# Altium project UZ_isoJTAG_Adapter.PrjPcb
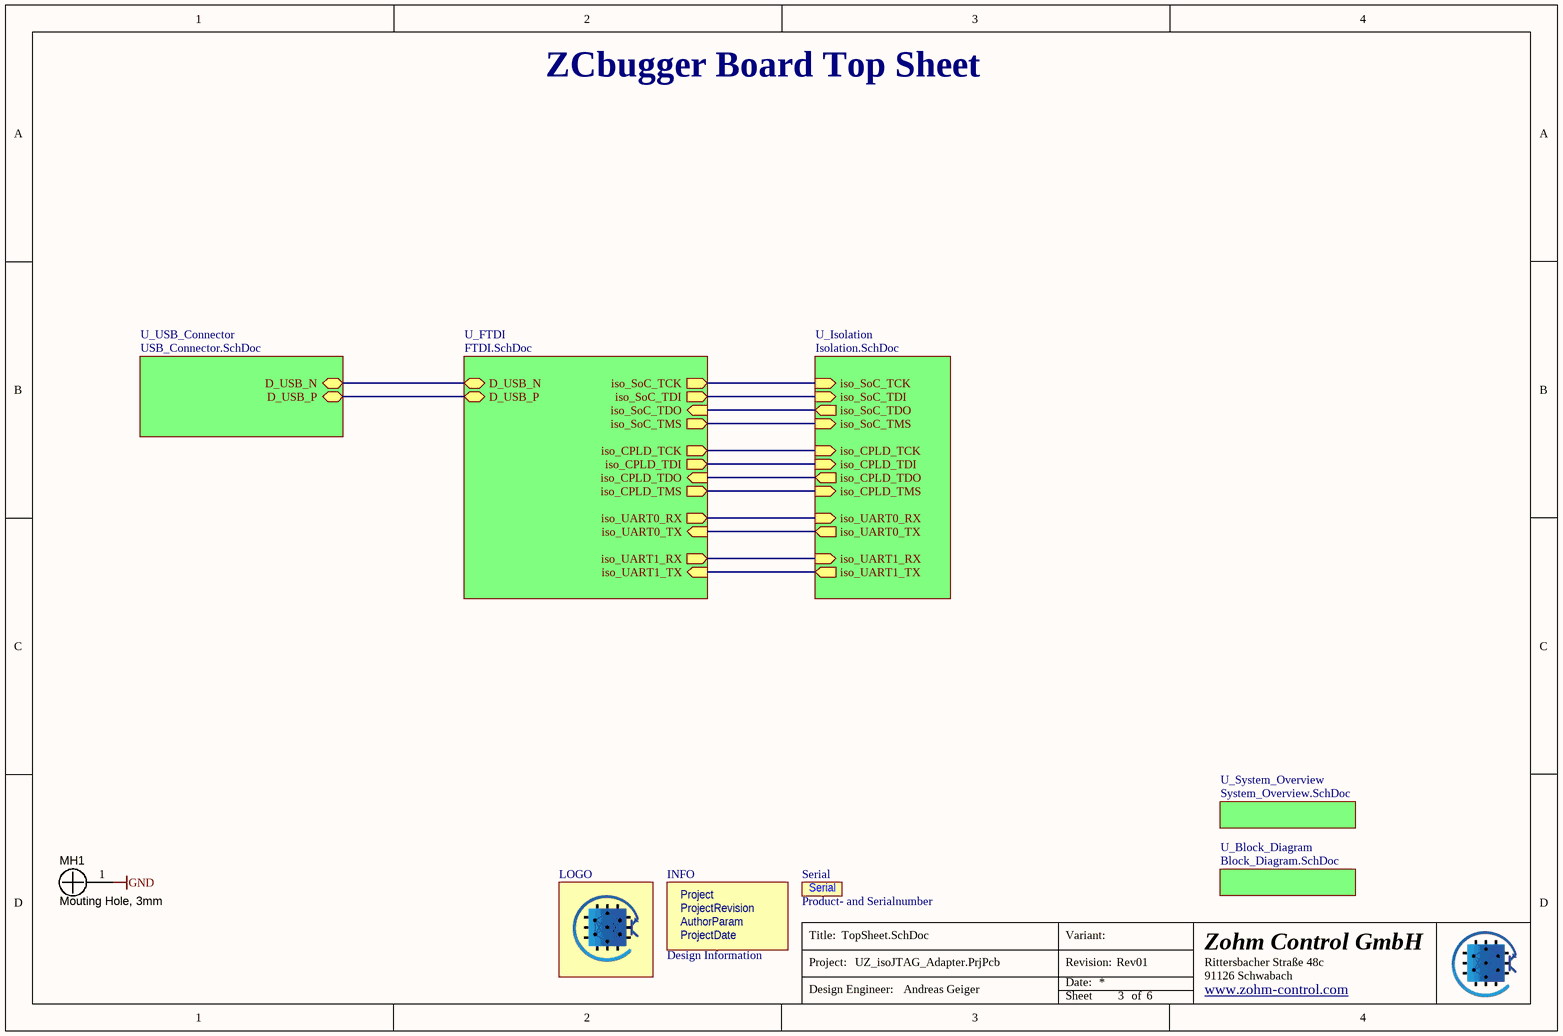
[diagram p0: TopSheet.SchDoc]
AuthorParam: Andreas Geiger; GGG: 004; PPP: 001; Project: UZ_isoJTAG_Adapter; ProjectDate: 01/2024; ProjectRevision: Rev01; Rev: 01
6 sheets, 66 parts. Net scope: hierarchical (ports join the sheet entries above them; power ports are global).
Board file: UZ_isoJTAG_Adapter.PcbDoc
Sheets:
  TopSheet.SchDoc
    U_System_Overview = System_Overview.SchDoc
    U_Block_Diagram = Block_Diagram.SchDoc
    U_FTDI = FTDI.SchDoc
    U_Isolation = Isolation.SchDoc
    U_USB_Connector = USB_Connector.SchDoc

## Sheet TopSheet.SchDoc
size A4; Author: Andreas Geiger; CompanyName: Zohm Control GmbH; Address1: Rittersbacher Straße 48c; Address2: 91126 Schwabach; Address3: GERMANY; DocumentNumber: 3; SheetNumber: 3; SheetTotal: 6; Website: www.zohm-control.com

### Parts
INFO  Design Information  [Design_info]  (no BOM)
LOGO  ZC Logo  [ZC_Logo_FILLED_small]  (value not drawn)  (no BOM)
MH1  Mouting Hole, 3mm  [NY PMS 440 0025 PH]  (no BOM)
Serial  Product- and Serialnumber  [PN_and_SN]  (no BOM)

### Sub-sheets
U_Block_Diagram = Block_Diagram.SchDoc: no entries
U_FTDI = FTDI.SchDoc: D_USB_N (bidir), D_USB_P (bidir), iso_SoC_TCK (out), iso_SoC_TDI (out), iso_SoC_TDO (in), iso_SoC_TMS (out), iso_CPLD_TCK (out), iso_CPLD_TDI (out), iso_CPLD_TDO (in), iso_CPLD_TMS (out), iso_UART0_RX (out), iso_UART0_TX (in), iso_UART1_RX (out), iso_UART1_TX (in)
U_Isolation = Isolation.SchDoc: iso_SoC_TCK (in), iso_SoC_TDI (in), iso_SoC_TDO (out), iso_SoC_TMS (in), iso_CPLD_TCK (in), iso_CPLD_TDI (in), iso_CPLD_TDO (out), iso_CPLD_TMS (in), iso_UART0_RX (in), iso_UART0_TX (out), iso_UART1_RX (in), iso_UART1_TX (out)
U_System_Overview = System_Overview.SchDoc: no entries
U_USB_Connector = USB_Connector.SchDoc: D_USB_N (bidir), D_USB_P (bidir)

### Nets
GND: MH1.1
D_USB_N: sheet U_FTDI/D_USB_N, sheet U_USB_Connector/D_USB_N
D_USB_P: sheet U_FTDI/D_USB_P, sheet U_USB_Connector/D_USB_P
NetU1_12: sheet U_FTDI/iso_SoC_TCK, sheet U_Isolation/iso_SoC_TCK
NetU1_13: sheet U_FTDI/iso_SoC_TDI, sheet U_Isolation/iso_SoC_TDI
NetU1_14: sheet U_FTDI/iso_SoC_TDO, sheet U_Isolation/iso_SoC_TDO
NetU1_15: sheet U_FTDI/iso_SoC_TMS, sheet U_Isolation/iso_SoC_TMS
NetU1_22: sheet U_FTDI/iso_CPLD_TCK, sheet U_Isolation/iso_CPLD_TCK
NetU1_23: sheet U_FTDI/iso_CPLD_TDI, sheet U_Isolation/iso_CPLD_TDI
NetU1_24: sheet U_FTDI/iso_CPLD_TDO, sheet U_Isolation/iso_CPLD_TDO
NetU1_25: sheet U_FTDI/iso_CPLD_TMS, sheet U_Isolation/iso_CPLD_TMS
NetU1_32: sheet U_FTDI/iso_UART0_RX, sheet U_Isolation/iso_UART0_RX
NetU1_33: sheet U_FTDI/iso_UART0_TX, sheet U_Isolation/iso_UART0_TX
NetU1_42: sheet U_FTDI/iso_UART1_RX, sheet U_Isolation/iso_UART1_RX
NetU1_46: sheet U_FTDI/iso_UART1_TX, sheet U_Isolation/iso_UART1_TX

### Notes on the sheet
- ZCbugger Board Top Sheet
- Title:
- Project:
- Date:
- Revision:
- Variant:
- Design Engineer:
- Sheet
- of
- (in symbol Design_info) Project; ProjectRevision; AuthorParam; ProjectDate

### Library data of the parts
INFO = Design_info
LOGO = ZC_LOGO: Company Logo; Created: 2021_09_22_AGeiger; ComponentLink1Description: Homepage; ComponentLink1URL: www.zohm-control.com; Component Type: Logo
MH1 = NY PMS 440 0025 PH: Machine Screw, Round, #4-40 x 1/4, Nylon, Philips panhead; MF: B&F Fastener Supply; MPN: NY PMS 440 0025 PH; Package: Screw; ComponentLink1Description: Datasheet Link; ComponentLink1URL: http://www.fasnetdirect.com/refguide/Nylpanms.pdf; Created: 2021_06_22_AGeiger; Supplier 1: Digi-Key; Supplier Part Number 1: H542-ND; Value: Mouting Hole, 3mm
Serial = PCB_ZC_PN_and_SN: Created: 2024_01_06_AGeiger; Value: Product- and Serialnumber

## Sheet System_Overview.SchDoc
size A4; Author: Andreas Geiger; CompanyName: Zohm Control GmbH; Address1: Rittersbacher Straße 48c; Address2: 91126 Schwabach; Address3: GERMANY; DocumentNumber: 1; SheetNumber: 1; SheetTotal: 6; Website: www.zohm-control.com
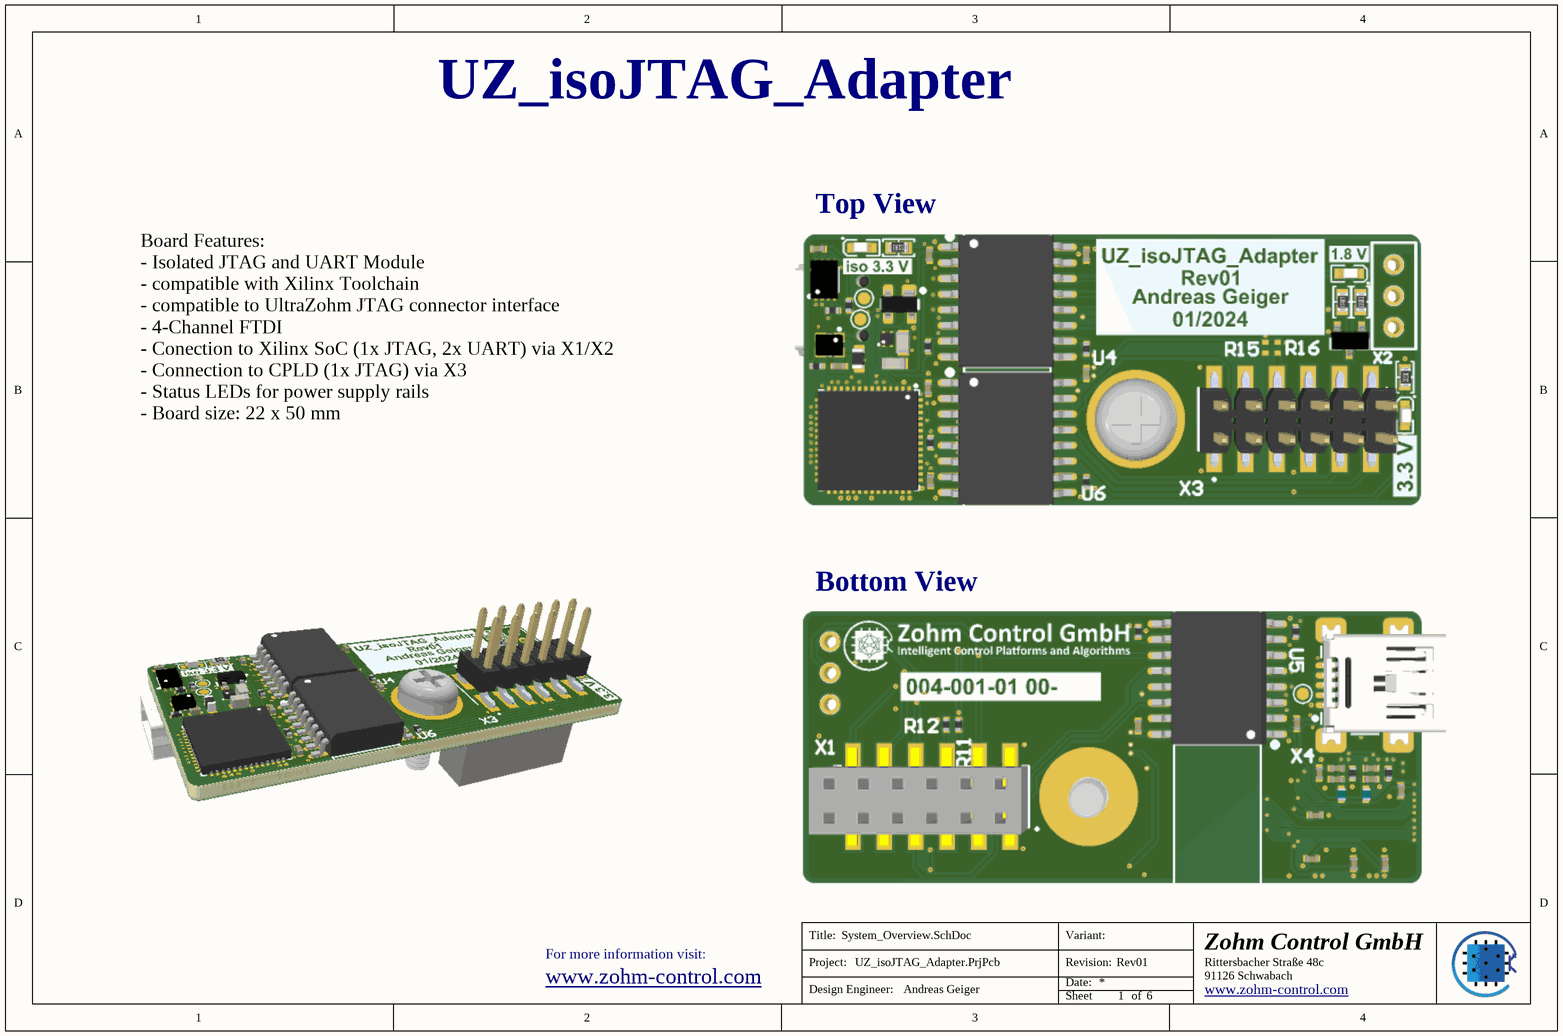
[diagram p1: System_Overview.SchDoc]

### Notes on the sheet
- UZ_isoJTAG_Adapter
- Top View
- Board Features:
  - Isolated JTAG and UART Module
  - compatible with Xilinx Toolchain
  - compatible to UltraZohm JTAG connector interface
  - 4-Channel FTDI
  - Conection to Xilinx SoC (1x JTAG, 2x UART) via X1/X2
  - Connection to CPLD (1x JTAG) via X3
  - Status LEDs for power supply rails
  - Board size: 22 x 50 mm
- Bottom View
- For more information visit:
- www.zohm-control.com <https://www.zohm-control.com>
- Title:
- Project:
- Date:
- Revision:
- Variant:
- Design Engineer:
- Sheet
- of

## Sheet Block_Diagram.SchDoc
size A4; Author: Andreas Geiger; CompanyName: Zohm Control GmbH; Address1: Rittersbacher Straße 48c; Address2: 91126 Schwabach; Address3: GERMANY; DocumentNumber: 2; SheetNumber: 2; SheetTotal: 6; Website: www.zohm-control.com
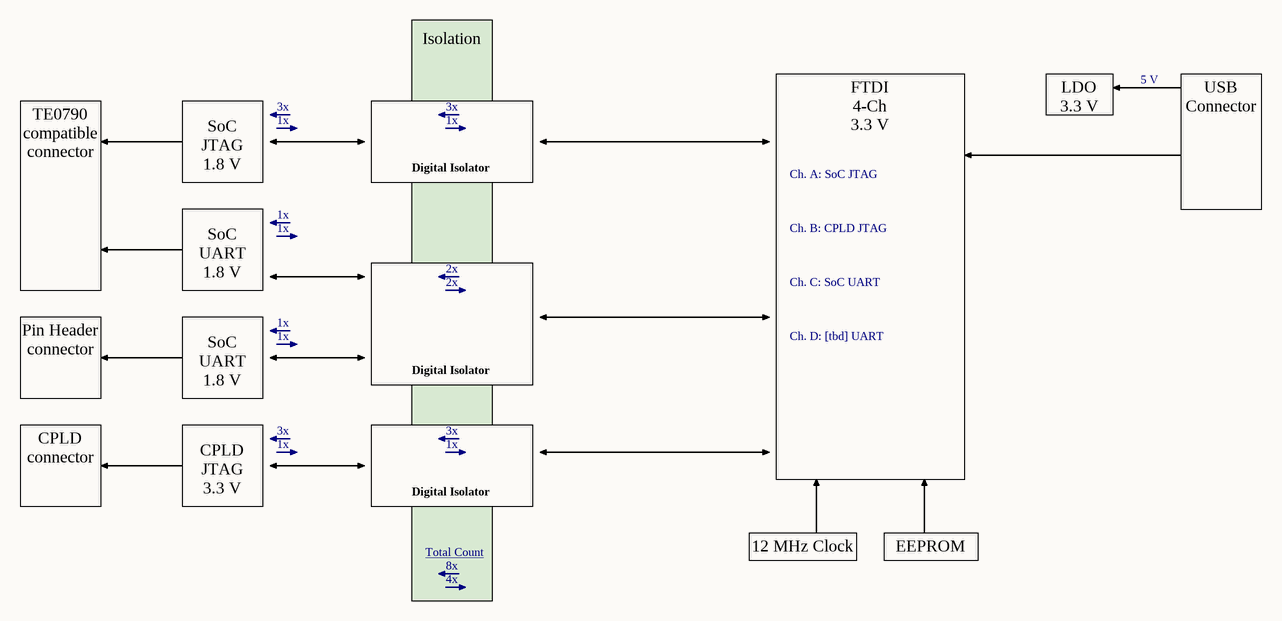
[diagram p2: Block_Diagram.SchDoc]

### Notes on the sheet
- 5 V
- 3x
- 1x
- LDO
  3.3 V
- SoC
  JTAG
  1.8 V
- Digital Isolator
- Ch. A: SoC JTAG
- Ch. B: CPLD JTAG
- USB
  Connector
- TE0790
  compatible
  connector
- SoC
  UART
  1.8 V
- 2x
- Ch. C: SoC UART
- Ch. D: [tbd] UART
- Pin Header
  connector
- CPLD
  connector
- CPLD
  JTAG
  3.3 V
- FTDI
  4-Ch
  3.3 V
- Total Count
- 8x
- 12 MHz Clock
- EEPROM
- Isolation
- 4x
- Title:
- Project:
- Date:
- Revision:
- Variant:
- Design Engineer:
- Sheet
- of

## Sheet FTDI.SchDoc
size A4; Author: Andreas Geiger; CompanyName: Zohm Control GmbH; Address1: Rittersbacher Straße 48c; Address2: 91126 Schwabach; Address3: GERMANY; DocumentNumber: 4; SheetNumber: 4; SheetTotal: 6; Website: www.zohm-control.com
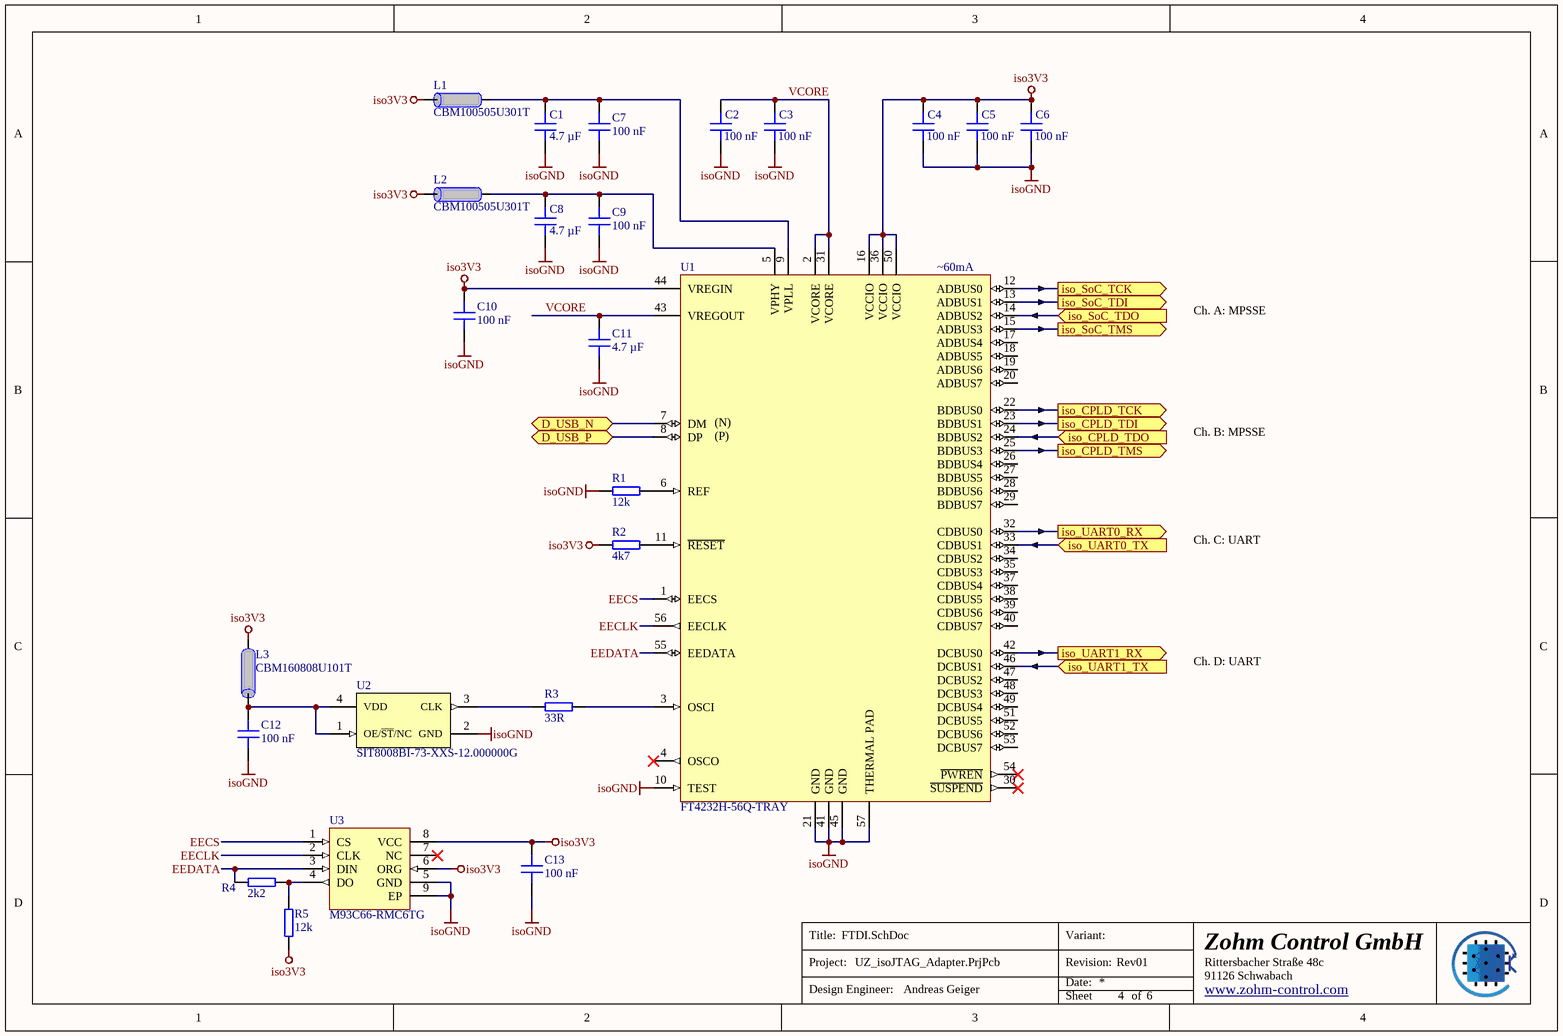
[diagram p3: FTDI.SchDoc]

### Parts
C1  4.7 µF  [C_0402_TE]
C2  100 nF  [C_0402_TE]
C3  100 nF  [C_0402_TE]
C4  100 nF  [C_0402_TE]
C5  100 nF  [C_0402_TE]
C6  100 nF  [C_0402_TE]
C7  100 nF  [C_0402_TE]
C8  4.7 µF  [C_0402_TE]
C9  100 nF  [C_0402_TE]
C10  100 nF  [C_0402_TE]
C11  4.7 µF  [C_0402_TE]
C12  100 nF  [C_0402_TE]
C13  100 nF  [C_0402_TE]
L1  CBM100505U301T  [IND_0402_TE]
L2  CBM100505U301T  [IND_0402_TE]
L3  CBM160808U101T  [IND_0603_TE]
R1  12k  [R_0402_TE]
R2  4k7  [R_0402_TE]
R3  33R  [R_0402_TE]
R4  2k2  [R_0402_TE]
R5  12k  [R_0402_TE]
U1  FT4232H-56Q-TRAY  [QFN50P800X800-57T610X610N]
U2  SIT8008BI-73-XXS-12.000000G  [2016]
U3  M93C66-RMC6TG  [UFDFPN8]

### Ports
D_USB_N (bidir), D_USB_P (bidir), iso_CPLD_TCK (out), iso_CPLD_TDI (out), iso_CPLD_TDO (in), iso_CPLD_TMS (out), iso_SoC_TCK (out), iso_SoC_TDI (out), iso_SoC_TDO (in), iso_SoC_TMS (out), iso_UART0_RX (out), iso_UART0_TX (in), iso_UART1_RX (out), iso_UART1_TX (in)

### Nets
iso3V3: C4.2 C5.2 C6.2 C10.2 C13.2 L1.2 L2.2 L3.1 R2.1 R5.1 U1.16(VCCIO) U1.36(VCCIO) U1.44(VREGIN) U1.50(VCCIO) U3.6(ORG) U3.8(VCC)
isoGND: C1.1 C2.1 C3.1 C4.1 C5.1 C6.1 C7.1 C8.1 C9.1 C10.1 C11.1 C12.1 C13.1 R1.1 U1.10(TEST) U1.21(GND) U1.41(GND) U1.45(GND) U1.57(THERMAL_PAD) U2.2(GND) U3.5(GND) U3.9(EP)
D_USB_N: U1.7(DM) ; port D_USB_N
D_USB_P: U1.8(DP) ; port D_USB_P
EECLK: U1.56(EECLK) U3.2(CLK)
EECS: U1.1(EECS) U3.1(CS)
EEDATA: R4.1 U1.55(EEDATA) U3.3(DIN)
VCORE: C2.2 C3.2 C11.2 U1.2(VCORE) U1.31(VCORE) U1.43(VREGOUT)
NetC1_2: C1.2 C7.2 L1.1 U1.9(VPLL)
NetC8_2: C8.2 C9.2 L2.1 U1.5(VPHY)
NetC12_2: C12.2 L3.2 U2.1(OE/~{ST}/NC) U2.4(VDD)
NetR1_2: R1.2 U1.6(REF)
NetR2_2: R2.2 U1.11(~{RESET})
NetR3_1: R3.1 U2.3(CLK)
NetR3_2: R3.2 U1.3(OSCI)
NetR4_2: R4.2 R5.2 U3.4(DO)
NetU1_12: U1.12(ADBUS0) ; port iso_SoC_TCK
NetU1_13: U1.13(ADBUS1) ; port iso_SoC_TDI
NetU1_14: U1.14(ADBUS2) ; port iso_SoC_TDO
NetU1_15: U1.15(ADBUS3) ; port iso_SoC_TMS
NetU1_22: U1.22(BDBUS0) ; port iso_CPLD_TCK
NetU1_23: U1.23(BDBUS1) ; port iso_CPLD_TDI
NetU1_24: U1.24(BDBUS2) ; port iso_CPLD_TDO
NetU1_25: U1.25(BDBUS3) ; port iso_CPLD_TMS
NetU1_32: U1.32(CDBUS0) ; port iso_UART0_RX
NetU1_33: U1.33(CDBUS1) ; port iso_UART0_TX
NetU1_42: U1.42(DCBUS0) ; port iso_UART1_RX
NetU1_46: U1.46(DCBUS1) ; port iso_UART1_TX

Not connected (* = marked no-connect by the designer): U1 4(OSCO)* 17(ADBUS4) 18(ADBUS5) 19(ADBUS6) 20(ADBUS7) 26(BDBUS4) 27(BDBUS5) 28(BDBUS6) 29(BDBUS7) 30(~{SUSPEND})* 34(CDBUS2) 35(CDBUS3) 37(CDBUS4) 38(CDBUS5) 39(CDBUS6) 40(CDBUS7) 47(DCBUS2) 48(DCBUS3) 49(DCBUS4) 51(DCBUS5) 52(DCBUS6) 53(DCBUS7) 54(~{PWREN})*; U3 7(NC)*

### Notes on the sheet
- (near U1) ~60mA
- Ch. A: MPSSE
- Ch. B: MPSSE
- Ch. C: UART
- Ch. D: UART
- Title:
- Project:
- Date:
- Revision:
- Variant:
- Design Engineer:
- Sheet
- of
- (in symbol FT4232H-56Q-TRAY) (N); (P)

### Library data of the parts
C1 C8 C11 = CL05A475MQ5NRNC: 6.3V 4.7uF X5R ±20% 0402 Multilayer Ceramic Capacitors MLCC - SMD/SMT ROHS; Manufacturer: Samsung Electro-Mechanics; Voltage Rating: 6.3 VDC; Created from: AGeiger; Manufacturer Part Number: CL05A475MQ5NRNC; PartID: 143; Created On: 13.12.2023 21:58:39; ComponentLink1Description: Datasheet; ComponentLink1URL: https://datasheet.lcsc.com/lcsc/1810231822_Samsung-Electro-Mechanics-CL05A475MQ5NRNC_C307423.pdf; Component Type: Capacitor 0402; Device Package: 0402; Last Updated: 13.12.2023 21:58:39; Mounting Type: SMD; Operating Temperature: -55 to +85°C; Series: X5R; Supplier 1: LCSC; Supplier Part Number 1: C307423; Type: Capacitor; Tolerance: 20 %; Value: 4.7 µF; Live Cycle Status: 1; LCSC Part Number: C307423
C2-C7 C9 C10 C12 C13 = GRM155R71H104KE14D: 50V 100nF X7R ±10% 0402 Multilayer Ceramic Capacitors MLCC - SMD/SMT ROHS; Manufacturer: Murata Electronics; Voltage Rating: 50 VDC; Created from: AGeiger; Manufacturer Part Number: GRM155R71H104KE14D; PartID: 144; Created On: 13.12.2023 22:03:54; ComponentLink1Description: Datasheet; ComponentLink1URL: https://datasheet.lcsc.com/lcsc/1809272047_Murata-Electronics-GRM155R71H104KE14D_C77020.pdf; Component Type: Capacitor 0402; Device Package: 0402; Last Updated: 13.12.2023 22:03:54; Mounting Type: SMD; Operating Temperature: -55 to +125°C; Series: X7R; Supplier 1: LCSC; Supplier Part Number 1: C77020; Type: Capacitor; Tolerance: 10 %; Value: 100 nF; Live Cycle Status: 1; LCSC Part Number: C77020
L1 L2 = CBM100505U301T: 300mΩ ±25% 300Ω@100MHz 0402 Ferrite Beads ROHS; Manufacturer: FH (Guangdong Fenghua Advanced Tech); DC current: 0.6 A; Value: 300 mOhm; Created from: AGeiger; Manufacturer Part Number: CBM100505U301T; PartID: 20; Created On: 13.12.2023 22:24:41; ComponentLink1Description: Datasheet; ComponentLink1URL: https://datasheet.lcsc.com/lcsc/2304140030_FH--Guangdong-Fenghua-Advanced-Tech-CBM100505U301T_C394406.pdf; Component Type: Ferrite Beads; Device Package: 0402; Last Updated: 13.12.2023 22:24:41; Mounting Type: SMD; Operating Temperature: -40 to +85°C; Supplier 1: LCSC; Supplier Part Number 1: C394406; Type: Ferrite Bead; Live Cycle Status: 1; LCSC Part Number: C394406
L3 = CBM160808U101T: 60mΩ ±25% 100Ω@100MHz 0603 Ferrite Beads ROHS; Manufacturer: FH (Guangdong Fenghua Advanced Tech); DC current: 2.5 A; Value: 60 mOhm; Created from: AGeiger; Manufacturer Part Number: CBM160808U101T; PartID: 21; Created On: 13.12.2023 22:36:14; ComponentLink1Description: Datasheet; ComponentLink1URL: https://datasheet.lcsc.com/lcsc/1912111437_FH--Guangdong-Fenghua-Advanced-Tech-CBM160808U101T_C361675.pdf; Component Type: Ferrite Beads; Device Package: 0603; Last Updated: 13.12.2023 22:36:14; Mounting Type: SMD; Operating Temperature: -40 to +85°C; Supplier 1: LCSC; Supplier Part Number 1: C361675; Type: Ferrite Bead; Live Cycle Status: 1; LCSC Part Number: C361675
R1 R5 = RC0402FR-0712KL: 62.5mW Thick Film Resistors ±100ppm/℃ ±1% 12kΩ 0402 Chip Resistor - Surface Mount ROHS; Manufacturer: YAGEO; Created from: AGeiger; Manufacturer Part Number: RC0402FR-0712KL; PartID: 307; Created On: 13.12.2023 21:39:32; ComponentLink1Description: Datasheet; ComponentLink1URL: https://datasheet.lcsc.com/lcsc/2304140030_YAGEO-RC0402FR-0712KL_C114760.pdf; Component Type: SMD resistor; Device Package: 0402; Last Updated: 13.12.2023 21:39:32; Mounting Type: SMD; Supplier 1: LCSC; Supplier Part Number 1: C114760; Type: Resistor; Tolerance: 1%; Value: 12k; Live Cycle Status: 1; LCSC Part Number: C114760
R2 = RC0402FR-074K7L: 62.5mW Thick Film Resistors ±100ppm/℃ ±1% 4.7kΩ 0402 Chip Resistor - Surface Mount ROHS; Manufacturer: YAGEO; Created from: AGeiger; Manufacturer Part Number: RC0402FR-074K7L; PartID: 306; Created On: 13.12.2023 21:34:05; ComponentLink1Description: Datasheet; ComponentLink1URL: https://datasheet.lcsc.com/lcsc/2304140030_YAGEO-RC0402FR-074K7L_C105871.pdf; Component Type: SMD resistor; Device Package: 0402; Last Updated: 13.12.2023 21:39:32; Mounting Type: SMD; Supplier 1: LCSC; Supplier Part Number 1: C105871; Type: Resistor; Tolerance: 1%; Value: 4k7; Live Cycle Status: 1; LCSC Part Number: C105871
R3 = RC0402FR-0733RL: 62.5mW Thick Film Resistors ±100ppm/℃ ±1% 33Ω 0402 Chip Resistor - Surface Mount ROHS; Manufacturer: YAGEO; Created from: AGeiger; Manufacturer Part Number: RC0402FR-0733RL; PartID: 308; Created On: 13.12.2023 22:29:11; ComponentLink1Description: Datasheet; ComponentLink1URL: https://datasheet.lcsc.com/lcsc/2304140030_YAGEO-RC0402FR-0733RL_C138002.pdf; Component Type: SMD resistor; Device Package: 0402; Last Updated: 13.12.2023 22:29:11; Mounting Type: SMD; Supplier 1: LCSC; Supplier Part Number 1: C138002; Type: Resistor; Tolerance: 1%; Value: 33R; Live Cycle Status: 1; LCSC Part Number: C138002
R4 = RC0402FR-072K2L: 62.5mW Thick Film Resistors ±100ppm/℃ ±1% 2.2kΩ 0402 Chip Resistor - Surface Mount ROHS; Manufacturer: YAGEO; Created from: AGeiger; Manufacturer Part Number: RC0402FR-072K2L; PartID: 309; Created On: 13.12.2023 22:31:34; ComponentLink1Description: Datasheet; ComponentLink1URL: https://datasheet.lcsc.com/lcsc/2304140030_YAGEO-RC0402FR-072K2L_C114762.pdf; Component Type: SMD resistor; Device Package: 0402; Last Updated: 13.12.2023 22:31:34; Mounting Type: SMD; Supplier 1: LCSC; Supplier Part Number 1: C114762; Type: Resistor; Tolerance: 1%; Value: 2k2; Live Cycle Status: 1; LCSC Part Number: C114762
U1 = FT4232H-56Q-TRAY: USB Interface IC Quad 480Mbs 4 UART USB 2.0 12Mbit; Manufacturer: FTDI; Created from: AGeiger; PartID: 1; Created On: 26.11.2023 16:58:07; ComponentLink1Description: Datasheet; ComponentLink1URL: https://www.mouser.de/datasheet/2/163/DS_FT4232H-1621254.pdf; Component Type: USB Controller; Device Package: VQFN-56; Last Updated: 26.11.2023 16:58:07; Manufacturer Part Number: FT4232H-56Q-TRAY; Mounting Type: SMD; Operating Temperature: -40 to 85 °C; Series: FT4232H; Supplier 1: Mouser; Supplier Part Number 1: 895-FT4232H-56Q-TRAY; Value: FT4232H-56Q-TRAY; LCSC Part Number: C1521561
U2 = SIT8008BI-73-XXS-12.000000G: Clock-Standardoszillatoren -40 to 85C, 2016, 50ppm, 2.25V-3.63V, 12MHz, ST, 250 pcs T&R 8 mm; Manufacturer: SiTime; Created from: AGeiger; Manufacturer Part Number: SIT8008BI-73-XXS-12.000000G; PartID: 2; Created On: 11.01.2024 17:02:48; ComponentLink1Description: Datasheet; ComponentLink1URL: https://www.mouser.de/datasheet/2/371/SiT8008B_datasheet-1291019.pdf; Component Type: Oscillator; Device Package: 2016; Last Updated: 11.01.2024 17:02:48; Mounting Type: SMD; Operating Temperature: -40 to +85 °C; Supplier 1: Mouser; Supplier Part Number 1: 788-8008BI73XXS120G; Value: 12 MHz; LCSC Part Number: C1508636
U3 = M93C66-RMC6TG: 4Kbit MICROWIRE EE 1.8 V to 5.5 V; Manufacturer: STMicroelectronics; Created from: AGeiger; Manufacturer Part Number: M93C66-RMC6TG; PartID: 2; Created On: 19.11.2023 15:06:30; ComponentLink1Description: Datasheet; ComponentLink1URL: https://www.mouser.de/datasheet/2/389/m93c46_w-1849748.pdf; Component Type: EEPROM; Device Package: UFDFPN-8; Last Updated: 19.11.2023 21:39:04; Mounting Type: SMD; Operating Temperature: -40 to +85 °C; Series: M93xxx; Supplier 1: Mouser; Supplier Part Number 1: 511-M93C66-RMC6TG; Supplier 2: LCSC; Supplier Part Number 2: C2061956; Type: Memory; Value: M93C66-RMC6TG; LCSC Part Number: C2061956

## Sheet Isolation.SchDoc
size A4; Author: Andreas Geiger; CompanyName: Zohm Control GmbH; Address1: Rittersbacher Straße 48c; Address2: 91126 Schwabach; Address3: GERMANY; DocumentNumber: 5; SheetNumber: 5; SheetTotal: 6; Website: www.zohm-control.com
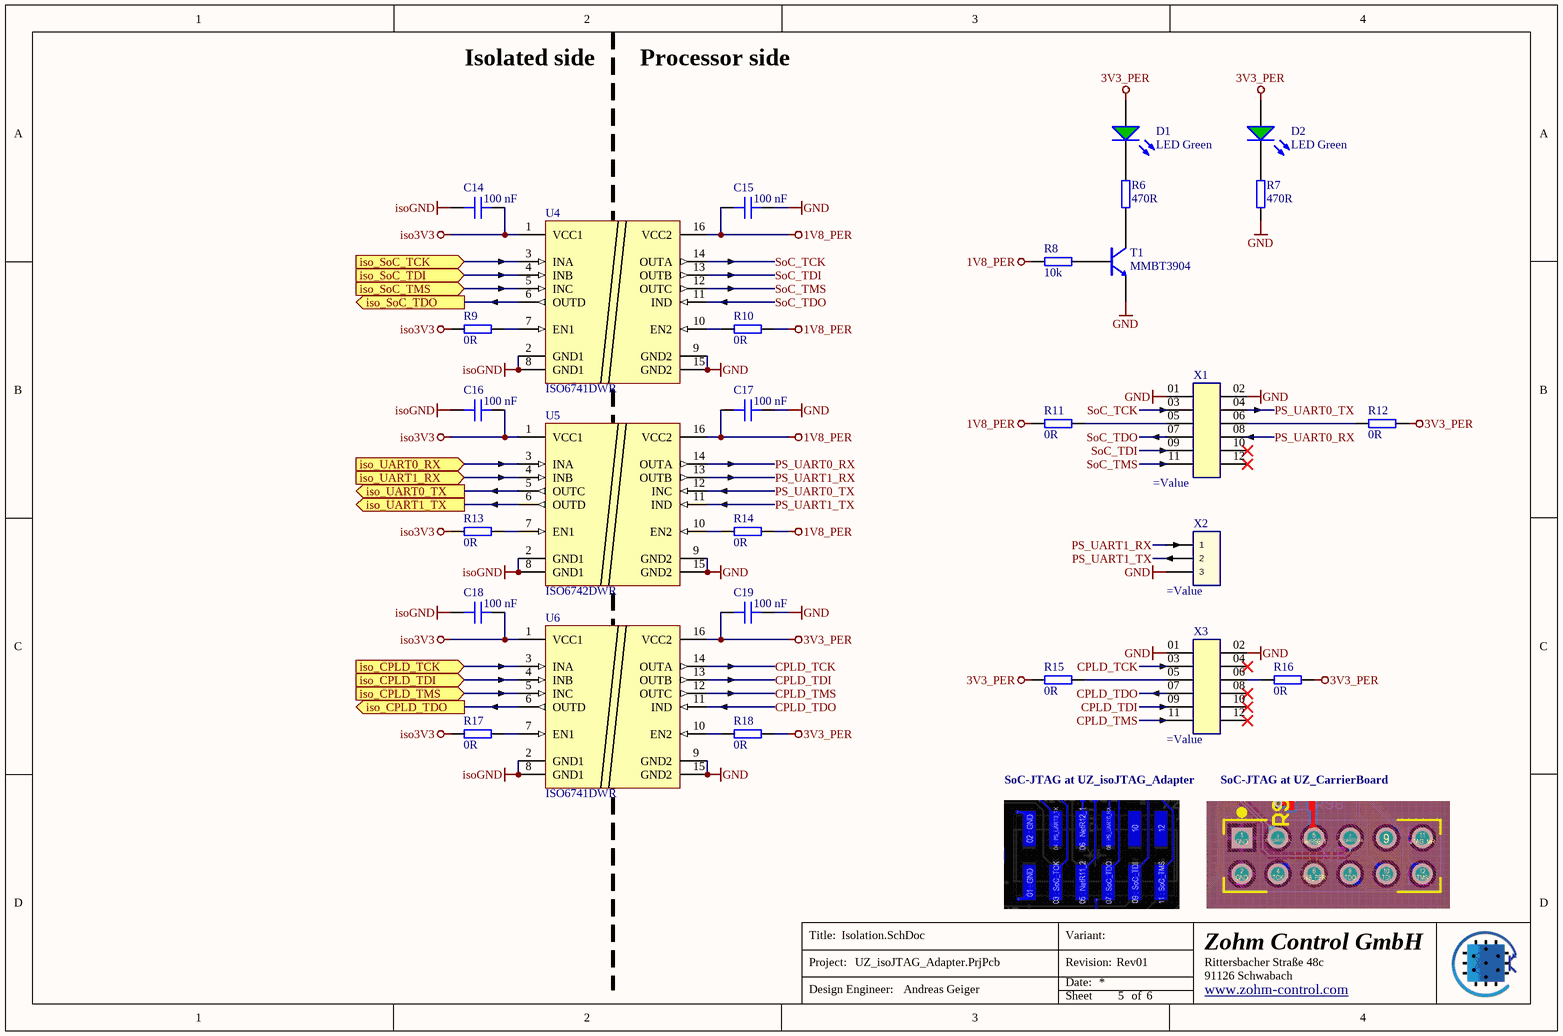
[diagram p4: Isolation.SchDoc]

### Parts
C14  100 nF  [C_0402_TE]
C15  100 nF  [C_0402_TE]
C16  100 nF  [C_0402_TE]
C17  100 nF  [C_0402_TE]
C18  100 nF  [C_0402_TE]
C19  100 nF  [C_0402_TE]
D1  LED Green  [WL-SMCW_0603]
D2  LED Green  [WL-SMCW_0603]
R6  470R  [RES 0603_1608]
R7  470R  [RES 0603_1608]
R8  10k  [RES 0603_1608]
R9  0R  [R_0402_TE]
R10  0R  [R_0402_TE]
R11  0R  [R_0402_TE]
R12  0R  [R_0402_TE]
R13  0R  [R_0402_TE]
R14  0R  [R_0402_TE]
R15  0R  [R_0402_TE]
R16  0R  [R_0402_TE]
R17  0R  [R_0402_TE]
R18  0R  [R_0402_TE]
T1  MMBT3904  [SOT-23-3]
U4  ISO6741DWR  [SOIC127P1030X265-16N]
U5  ISO6742DWR  [SOIC127P1030X265-16N]
U6  ISO6741DWR  [SOIC127P1030X265-16N]
X1  (no value)  [SSW-106-22-F-D-VS]
X2  (no value)  [TSW-103-XX-XXX-S]
X3  (no value)  [TSM-106-01-L-DV]

### Ports
iso_CPLD_TCK (in), iso_CPLD_TDI (in), iso_CPLD_TDO (out), iso_CPLD_TMS (in), iso_SoC_TCK (in), iso_SoC_TDI (in), iso_SoC_TDO (out), iso_SoC_TMS (in), iso_UART0_RX (in), iso_UART0_TX (out), iso_UART1_RX (in), iso_UART1_TX (out)

### Nets
1V8_PER: C15.2 C17.2 R8.2 R10.2 R11.1 R14.2 U4.16(VCC2) U5.16(VCC2)
3V3_PER: C19.2 D1.2(A) D2.2(A) R12.2 R15.1 R16.2 R18.2 U6.16(VCC2)
GND: C15.1 C17.1 C19.1 R7.1 T1.2(EMITTER) U4.9(GND2) U4.15(GND2) U5.9(GND2) U5.15(GND2) U6.9(GND2) U6.15(GND2) X1.01 X1.02 X2.3 X3.01 X3.02
iso3V3: C14.1 C16.1 C18.1 R9.1 R13.1 R17.1 U4.1(VCC1) U5.1(VCC1) U6.1(VCC1)
isoGND: C14.2 C16.2 C18.2 U4.2(GND1) U4.8(GND1) U5.2(GND1) U5.8(GND1) U6.2(GND1) U6.8(GND1)
CPLD_TCK: U6.14(OUTA) X3.03
CPLD_TDI: U6.13(OUTB) X3.09
CPLD_TDO: U6.11(IND) X3.07
CPLD_TMS: U6.12(OUTC) X3.11
PS_UART0_RX: U5.14(OUTA) X1.08
PS_UART0_TX: U5.12(INC) X1.04
PS_UART1_RX: U5.13(OUTB) X2.1
PS_UART1_TX: U5.11(IND) X2.2
SoC_TCK: U4.14(OUTA) X1.03
SoC_TDI: U4.13(OUTB) X1.09
SoC_TDO: U4.11(IND) X1.07
SoC_TMS: U4.12(OUTC) X1.11
NetD1_1: D1.1(K) R6.2
NetD2_1: D2.1(K) R7.2
NetR6_1: R6.1 T1.3(COLLECTOR)
NetR8_1: R8.1 T1.1(BASIS)
NetR9_2: R9.2 U4.7(EN1)
NetR10_1: R10.1 U4.10(EN2)
NetR11_2: R11.2 X1.05
NetR12_1: R12.1 X1.06
NetR13_2: R13.2 U5.7(EN1)
NetR14_1: R14.1 U5.10(EN2)
NetR15_2: R15.2 X3.05
NetR16_1: R16.1 X3.06
NetR17_2: R17.2 U6.7(EN1)
NetR18_1: R18.1 U6.10(EN2)
NetU1_12: U4.3(INA) ; port iso_SoC_TCK
NetU1_13: U4.4(INB) ; port iso_SoC_TDI
NetU1_14: U4.6(OUTD) ; port iso_SoC_TDO
NetU1_15: U4.5(INC) ; port iso_SoC_TMS
NetU1_22: U6.3(INA) ; port iso_CPLD_TCK
NetU1_23: U6.4(INB) ; port iso_CPLD_TDI
NetU1_24: U6.6(OUTD) ; port iso_CPLD_TDO
NetU1_25: U6.5(INC) ; port iso_CPLD_TMS
NetU1_32: U5.3(INA) ; port iso_UART0_RX
NetU1_33: U5.5(OUTC) ; port iso_UART0_TX
NetU1_42: U5.4(INB) ; port iso_UART1_RX
NetU1_46: U5.6(OUTD) ; port iso_UART1_TX

Not connected (* = marked no-connect by the designer): X1 10* 12*; X3 04* 08* 10* 12*

### Notes on the sheet
- Isolated side
- Processor side
- SoC-JTAG at UZ_isoJTAG_Adapter
- SoC-JTAG at UZ_CarrierBoard
- Title:
- Project:
- Date:
- Revision:
- Variant:
- Design Engineer:
- Sheet
- of

### Library data of the parts
C14-C19 = GRM155R71H104KE14D: as C2 on sheet FTDI; Manufacturer Part Number: GRM155R71H104KE14D; PartID: 144; Created On: 13.12.2023 22:03:54; ComponentLink1Description: Datasheet; ComponentLink1URL: https://datasheet.lcsc.com/lcsc/1809272047_Murata-Electronics-GRM155R71H104KE14D_C77020.pdf; Component Type: Capacitor 0402; Device Package: 0402; Last Updated: 13.12.2023 22:03:54; Mounting Type: SMD; Operating Temperature: -55 to +125°C; Series: X7R; Supplier 1: LCSC; Supplier Part Number 1: C77020; Type: Capacitor; Tolerance: 10 %; Value: 100 nF; Live Cycle Status: 1; LCSC Part Number: C77020
D1 D2 = 19-217/GHC-YR1S2/3T: LED GREEN 520~535NM 112~258MCD@20MA TOP VIEW 0603 ROHS; Manufacturer: Everlight Elec; Type: Standard; Created from: T. Wendt; Forward Current I_f: 20 mA; Forward Voltage U_f: 3.3 V; Wavelength: 530 nm; Light Intensity: 285 mcd; Nominal Power: 83 mW; Manufacturer Part Number: 19-217/GHC-YR1S2/3T; PartID: 7; Created On: 03.03.2021 10:06:23; ComponentLink1Description: Datasheet; ComponentLink1URL: https://datasheet.lcsc.com/szlcsc/Everlight-Elec-19-217-GHC-YR1S2-3T_C72043.pdf; Component Type: LED Diode; Device Package: 0603; Last Updated: 04.03.2021 09:02:49; Mounting Type: SMD; Operating Temperature: -40 - 85 °C; Supplier 1: LCSC; Supplier Part Number 1: C72043; Supplier 2: Mouser; Supplier Part Number 2: 638-19217GHCYR1S23T; Live Cycle Status: 1; Stock number: not stored; Color: green; LCSC Part Number: C72043
R6 R7 = RK73B1JTTD471J: SMD resistor E24 series; Manufacturer: KOA Speer; Tolerance: 5%; Created from: MGremer; Manufacturer Part Number: RK73B1JTTD471J; PartID: 66; Created On: 14.12.2020 16:17:14; ComponentLink1Description: Datasheet; ComponentLink1URL: https://www.mouser.de/datasheet/2/219/RK73B-1825463.pdf; Component Type: SMD resistor; Device Package: 0603; Last Updated: 04.03.2021 10:03:02; Mounting Type: SMD; Supplier 1: Mouser; Supplier Part Number 1: 660-RK73B1JTTD471J; Supplier 2: LCSC; Supplier Part Number 2: C23179; Type: Resistor; Value: 470R; Live Cycle Status: 1; Stock number: Labor SMD Container; LCSC Part Number: C23179
R8 = 0603WAF1002T5E: SMD resistor 1%; Manufacturer: UNI-ROYAL; Created from: AGeiger; Manufacturer Part Number: 0603WAF1002T5E; PartID: 265; Created On: 01.06.2023 06:49:29; ComponentLink1Description: Datasheet; ComponentLink1URL: https://datasheet.lcsc.com/lcsc/2206010045_UNI-ROYAL-Uniroyal-Elec-0603WAF1002T5E_C25804.pdf; Component Type: SMD resistor; Device Package: 0603; Last Updated: 01.06.2023 06:49:29; Mounting Type: SMD; Supplier 1: LCSC; Supplier Part Number 1: C25804; Type: Resistor; Tolerance: 1%; Value: 10k; Live Cycle Status: 1; LCSC Part Number: C25804
R9-R18 = RC0402JR-070RL: 62.5mW Thick Film Resistors 50V 0Ω 0402 Chip Resistor - Surface Mount ROHS; Manufacturer: YAGEO; Tolerance: 1%; Created from: AGeiger; Manufacturer Part Number: RC0402JR-070RL; PartID: 310; Created On: 17.12.2023 14:16:27; ComponentLink1Description: Datasheet; ComponentLink1URL: https://datasheet.lcsc.com/lcsc/2304140030_YAGEO-RC0402JR-070RL_C60485.pdf; Component Type: SMD resistor; Device Package: 0402; Last Updated: 17.12.2023 14:16:27; Mounting Type: SMD; Supplier 1: LCSC; Supplier Part Number 1: C60485; Type: Resistor; Value: 0R; Live Cycle Status: 1; LCSC Part Number: C60485
T1 = MMBT3904: 40V 200mW 100@10mA,1V 200mA NPN SOT-23 Bipolar Transistors - BJT ROHS; Manufacturer: Jiangsu Changjing Electronics Technology; Type: NPN Bipolar Transistor; Value: 40V, 200mA; Created from: AGeiger; Manufacturer Part Number: MMBT3904; PartID: 5; Created On: 01.06.2023 08:49:03; ComponentLink1Description: Datasheet; ComponentLink1URL: https://datasheet.lcsc.com/lcsc/2207041900_Jiangsu-Changjing-Electronics-Technology-Co---Ltd--MMBT3904_C20526.pdf; Component Type: NPN Bipolar Transistor; Device Package: SOT-23-3; Last Updated: 01.06.2023 08:49:03; Mounting Type: SMD; Operating Temperature: -55 to +150 °C; Series: MMBT3904; Supplier 1: LCSC; Supplier Part Number 1: C20526; Live Cycle Status: 1; LCSC Part Number: C20526; Stock number: not stored
U4 U6 = ISO6741DWR: Digital Isolators General-purpose, quad-channel, 3/1 digital isolator 16-SOIC -40 to 125; Manufacturer: Texas Instruments; Created from: AGeiger; Manufacturer Part Number: ISO6741DWR; PartID: 1; Created On: 26.11.2023 18:06:34; ComponentLink1Description: Datasheet; ComponentLink1URL: https://www.ti.com/general/docs/suppproductinfo.tsp?distId=26&gotoUrl=https://www.ti.com/lit/gpn/iso6741; Component Type: Digital Isolator; Device Package: SOIC-16; Last Updated: 26.11.2023 18:06:34; Mounting Type: SMD; Operating Temperature: -40 to +125 °C; Series: ISO6741; Supplier 1: Mouser; Supplier Part Number 1: 595-ISO6741DWR; Type: Digital Isolator; Value: ISO6741DWR; LCSC Part Number: C5216432
U5 = ISO6742DWR: Digital Isolators General-purpose, quad-channel, 2/2 digital isolator; Manufacturer: Texas Instruments; Created from: AGeiger; Manufacturer Part Number: ISO6742DWR; PartID: 2; Created On: 26.11.2023 18:17:11; ComponentLink1Description: Datasheet; ComponentLink1URL: https://www.ti.com/general/docs/suppproductinfo.tsp?distId=26&gotoUrl=https://www.ti.com/lit/gpn/iso6742; Component Type: Digital Isolator; Device Package: SOIC-16; Last Updated: 26.11.2023 18:17:11; Mounting Type: SMD; Operating Temperature: -40 to +125 °C; Series: ISO6742; Supplier 1: Mouser; Supplier Part Number 1: 595-ISO6742DWR; Type: Digital Isolator; Value: ISO6742DWR; LCSC Part Number: C9900001820
X1 = SSW-106-22-F-D-VS: Tiger Buy™ Socket Strip with PCB Tails, .100" Pitch; Manufacturer: SAMTEC; Created from: AGeiger; Manufacturer Part Number: SSW-106-22-F-D-VS; PartID: 25; Created On: 17.12.2023 19:38:46; ComponentLink1Description: Datasheet; ComponentLink1URL: https://suddendocs.samtec.com/catalog_english/ssw_sm.pdf; Last Updated: 17.12.2023 19:38:46; Mounting Type: SMD; Operating Temperature: -55 °C to +105 °C; Series: SSW; Supplier 1: LCSC; Supplier Part Number 1: C2689175; Value: SSW-106-22-F-D-VS; LCSC Part Number: C2689175
X2 = TSW-103-07-L-S: Classic PCB Header Strips, 0.100" pitch; Manufacturer: SAMTEC; Created from: AGeiger; Created: 2020_11_26_AGeiger; Manufacturer Part Number: TSW-103-07-L-S; Value: TSW-103-07-L-S; PartID: 21; Created On: 26.06.2023 09:53:59; ComponentLink1Description: Datasheet; ComponentLink1URL: https://suddendocs.samtec.com/catalog_english/tsw_th.pdf; Last Updated: 26.06.2023 09:53:59; Mounting Type: SMD; Operating Temperature: -55 °C to +105 °C; Series: TSW; Supplier 1: LCSC; Supplier Part Number 1: C2937625; LCSC Part Number: C2937625
X3 = TSM-106-01-L-DV: .100" Surface Mount Terminal Strip; Manufacturer: SAMTEC; Created from: AGeiger; Manufacturer Part Number: TSM-106-01-L-DV; PartID: 26; Created On: 20.12.2023 09:27:24; ComponentLink1Description: Datasheet; ComponentLink1URL: https://suddendocs.samtec.com/catalog_english/tsm.pdf; Last Updated: 20.12.2023 09:27:24; Mounting Type: SMD; Operating Temperature: -55 °C to +105 °C; Series: TSM; Supplier 1: LCSC; Supplier Part Number 1: C180236; Value: TSM-106-01-L-DV; LCSC Part Number: C180236

## Sheet USB_Connector.SchDoc
size A4; Author: Andreas Geiger; CompanyName: Zohm Control GmbH; Address1: Rittersbacher Straße 48c; Address2: 91126 Schwabach; Address3: GERMANY; DocumentNumber: 6; SheetNumber: 6; SheetTotal: 6; Website: www.zohm-control.com
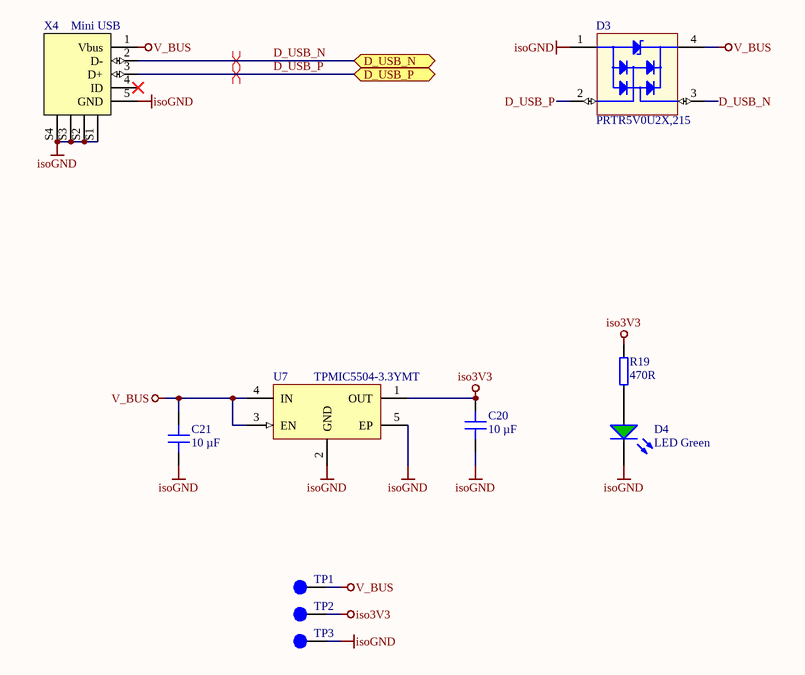
[diagram p5: USB_Connector.SchDoc]

### Parts
C20  10 µF  [C_0603]
C21  10 µF  [C_0603]
D3  PRTR5V0U2X,215  [SOT-143B-4]
D4  LED Green  [WL-SMCW_0603]
R19  470R  [RES 0603_1608]
TP1  Testpoint 1mm  [TP_1mm]  (value not drawn)  (no BOM)
TP2  Testpoint 1mm  [TP_1mm]  (value not drawn)  (no BOM)
TP3  Testpoint 1mm  [TP_1mm]  (value not drawn)  (no BOM)
U7  TPMIC5504-3.3YMT  [DFN-4-EP]
X4  Mini USB  [MINI_USB_5S_B _TYPE]

### Ports
D_USB_N (bidir), D_USB_P (bidir)

### Nets
iso3V3: C20.2 R19.2 TP2.1 U7.1(OUT)
isoGND: C20.1 C21.1 D3.1(GND) D4.1(K) TP3.1 U7.2(GND) U7.5(EP) X4.5(GND) X4.S1 X4.S2 X4.S3 X4.S4
V_BUS: C21.2 D3.4(REF) TP1.1 U7.3(EN) U7.4(IN) X4.1(Vbus)
D_USB_N: D3.3(I/O) X4.2(D-) ; port D_USB_N
D_USB_P: D3.2(I/O) X4.3(D+) ; port D_USB_P
NetD4_2: D4.2(A) R19.1

Not connected (* = marked no-connect by the designer): X4 4(ID)*

### Layout directives
differential pair: D_USB_N, D_USB_P

### Notes on the sheet
- Title:
- Project:
- Date:
- Revision:
- Variant:
- Design Engineer:
- Sheet
- of

### Library data of the parts
C20 C21 = CL10A106MO8NQNC: Capacitor 0603, 16 VDC, 10 µF, X5R; Manufacturer: Samsung Electro-Mechanics; Tolerance: 20 %; Voltage Rating: 16 VDC; Created from: AGeiger; Manufacturer Part Number: CL10A106MO8NQNC; PartID: 101; Created On: 22.08.2022 13:56:44; ComponentLink1Description: Datasheet; ComponentLink1URL: https://datasheet.lcsc.com/lcsc/1810261909_Samsung-Electro-Mechanics-CL10A106MO8NQNC_C92487.pdf; Component Type: Capacitor 0603; Device Package: 0603; Last Updated: 03.09.2022 10:50:43; Mounting Type: SMD; Operating Temperature: -55 - 85°C; Series: X5R; Supplier 1: LCSC; Supplier Part Number 1: C92487; Type: Capacitor; Value: 10 µF; Live Cycle Status: 1; LCSC Part Number: C92487
D3 = PRTR5V0U2X,215: ESD Suppressors / TVS Diodes PRTR5V0U2X/SOT143/SOT4; Manufacturer: Nexperia; Type: TVS-Diode; Created from: AGeiger; Manufacturer Part Number: PRTR5V0U2X,215; PartID: 10; Created On: 26.11.2023 17:14:11; ComponentLink1Description: Datasheet; ComponentLink1URL: https://www.mouser.de/datasheet/2/916/PRTR5V0U2X-2938759.pdf; Component Type: TVS Diode, ESD; Device Package: SOT-143B-4; Last Updated: 26.11.2023 17:16:37; Mounting Type: SMD; Operating Temperature: -40 to 85 °C; Supplier 1: Mouser; Supplier Part Number 1: 771-PRTR5V0U2X-T/R; Supplier 2: LCSC; Supplier Part Number 2: C12333; Value: PRTR5V0U2X,215; Live Cycle Status: 1; LCSC Part Number: C12333
D4 = 19-217/GHC-YR1S2/3T: as D1 on sheet Isolation; Manufacturer Part Number: 19-217/GHC-YR1S2/3T; PartID: 7; Created On: 03.03.2021 10:06:23; ComponentLink1Description: Datasheet; ComponentLink1URL: https://datasheet.lcsc.com/szlcsc/Everlight-Elec-19-217-GHC-YR1S2-3T_C72043.pdf; Component Type: LED Diode; Device Package: 0603; Last Updated: 04.03.2021 09:02:49; Mounting Type: SMD; Operating Temperature: -40 - 85 °C; Supplier 1: LCSC; Supplier Part Number 1: C72043; Supplier 2: Mouser; Supplier Part Number 2: 638-19217GHCYR1S23T; Live Cycle Status: 1; Stock number: not stored; Color: green; LCSC Part Number: C72043
R19 = RK73B1JTTD471J: as R6 on sheet Isolation; Manufacturer Part Number: RK73B1JTTD471J; PartID: 66; Created On: 14.12.2020 16:17:14; ComponentLink1Description: Datasheet; ComponentLink1URL: https://www.mouser.de/datasheet/2/219/RK73B-1825463.pdf; Component Type: SMD resistor; Device Package: 0603; Last Updated: 04.03.2021 10:03:02; Mounting Type: SMD; Supplier 1: Mouser; Supplier Part Number 1: 660-RK73B1JTTD471J; Supplier 2: LCSC; Supplier Part Number 2: C23179; Type: Resistor; Value: 470R; Live Cycle Status: 1; Stock number: Labor SMD Container; LCSC Part Number: C23179
TP1-TP3 = NULL: Manufacturer Part Number: NULL; Created from: AGeiger; Created: 2018_06_25_AGeiger; Value: Testpoint 1mm; PartID: 9; Created On: 20.09.2022 13:14:57; Component Type: Testpoint; Last Updated: 20.09.2022 13:15:39; Manufacturer: NULL; Supplier 1: NULL; Supplier Part Number 1: NULL; Type: Testpoint; Live Cycle Status: 1
U7 = TPMIC5504-3.3YMT: DFN-4-EP(1x1) Linear Voltage Regulators (LDO) ROHS; Manufacturer: TECH PUBLIC; Value: 3.3 V; Created from: AGeiger; Manufacturer Part Number: TPMIC5504-3.3YMT; PartID: 15; Created On: 26.11.2023 13:32:42; ComponentLink1Description: Datasheet; ComponentLink1URL: https://datasheet.lcsc.com/lcsc/2205241716_TECH-PUBLIC-TPMIC5504-3-3YMT_C3021135.pdf; Component Type: LDO; Device Package: SMD; Last Updated: 26.11.2023 13:32:42; Mounting Type: SMD; Operating Temperature: -40 to 125 °C; Series: TPMIC5504; Supplier 1: LCSC; Supplier Part Number 1: C3021135; Type: LDO; Live Cycle Status: 1; LCSC Part Number: C3021135; Stock number: not stored
X4 = MINI 5PTP: 1A 1 Surface Mount 5P Female -30℃~+80℃ SMD USB Connectors ROHS; Manufacturer: SHOU HAN; Created from: AGeiger; Manufacturer Part Number: MINI 5PTP; PartID: 24; Created On: 26.11.2023 17:41:34; ComponentLink1Description: Datasheet; ComponentLink1URL: https://datasheet.lcsc.com/lcsc/2101221940_SHOU-HAN-MINI-5PTP_C2681563.pdf; Last Updated: 26.11.2023 17:41:34; Mounting Type: SMD; Operating Temperature: -30 °C to +80 °C; Series: Mini USB; Supplier 1: LCSC; Supplier Part Number 1: C2681563; Value: Mini USB; LCSC Part Number: C2681563

## Nets that join several sheets
GND: TopSheet (MH1.1), Isolation (16 pins)
iso3V3: FTDI (16 pins), Isolation (9 pins), USB_Connector (C20.2 R19.2 TP2.1 U7.1)
isoGND: FTDI (22 pins), Isolation (9 pins), USB_Connector (12 pins)
D_USB_N: FTDI (U1.7), USB_Connector (D3.3 X4.2)
D_USB_P: FTDI (U1.8), USB_Connector (D3.2 X4.3)
NetU1_12: FTDI (U1.12), Isolation (U4.3)
NetU1_13: FTDI (U1.13), Isolation (U4.4)
NetU1_14: FTDI (U1.14), Isolation (U4.6)
NetU1_15: FTDI (U1.15), Isolation (U4.5)
NetU1_22: FTDI (U1.22), Isolation (U6.3)
NetU1_23: FTDI (U1.23), Isolation (U6.4)
NetU1_24: FTDI (U1.24), Isolation (U6.6)
NetU1_25: FTDI (U1.25), Isolation (U6.5)
NetU1_32: FTDI (U1.32), Isolation (U5.3)
NetU1_33: FTDI (U1.33), Isolation (U5.5)
NetU1_42: FTDI (U1.42), Isolation (U5.4)
NetU1_46: FTDI (U1.46), Isolation (U5.6)

## Assembly variants
Default: not fitted C11 R15 R16 R22 R23 R24 R25 R26 R27 R28 R29 R30 R31 R32 R33 R34 R35 R36 R37 R42 R44 R61 R? R? X2 X46 X47; alternate parts R21 -> 1206W4F0000T5E